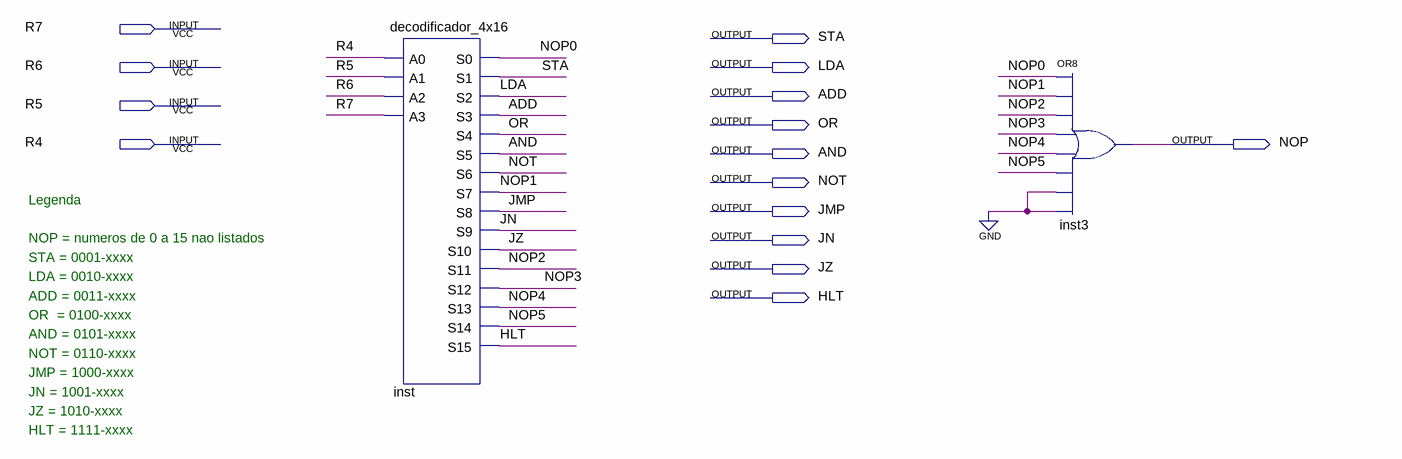
[diagram p0: schematic sheet]
// Quartus schematic uc_decodificador.bdf as structural Verilog: 2 symbols, 15 pins
module uc_decodificador (
  input  R7,
  input  R6,
  input  R5,
  input  R4,
  output STA,
  output LDA,
  output ADD,
  output OR,
  output NOP,
  output AND,
  output NOT,
  output JMP,
  output JN,
  output JZ,
  output HLT
);

  wire NOP0, NOP1, NOP2, NOP3, NOP4, NOP5;

  decodificador_4x16 inst (
    .A0(R4), .A1(R5), .A2(R6), .A3(R7), .S0(NOP0), .S1(STA), .S2(LDA), .S3(ADD), .S4(OR), .S5(AND), .S6(NOT),
    .S7(NOP1), .S8(JMP), .S9(JN), .S10(JZ), .S11(NOP2), .S12(NOP3), .S13(NOP4), .S14(NOP5), .S15(HLT));
  or inst3 (NOP, NOP0, NOP1, NOP2, NOP3, NOP4, NOP5, 1'b0, 1'b0);

  // Notes on the sheet:
  //   Legenda 
  //   NOP = numeros de 0 a 15 nao listados
  //   STA = 0001-xxxx
  //   LDA = 0010-xxxx
  //   ADD = 0011-xxxx
  //   OR  = 0100-xxxx
  //   AND = 0101-xxxx
  //   NOT = 0110-xxxx
  //   JMP = 1000-xxxx
  //   JN = 1001-xxxx
  //   JZ = 1010-xxxx
  //   HLT = 1111-xxxx
endmodule
